# EasyEDA schematic SCH_Akira Basic_2024-01-05.json

## Sheets
1 Sheet_1: TITLE: Akira Basic; REV: 1.2; Date: 2023-07-19; Sheet: 1/2; Company: Pen Design
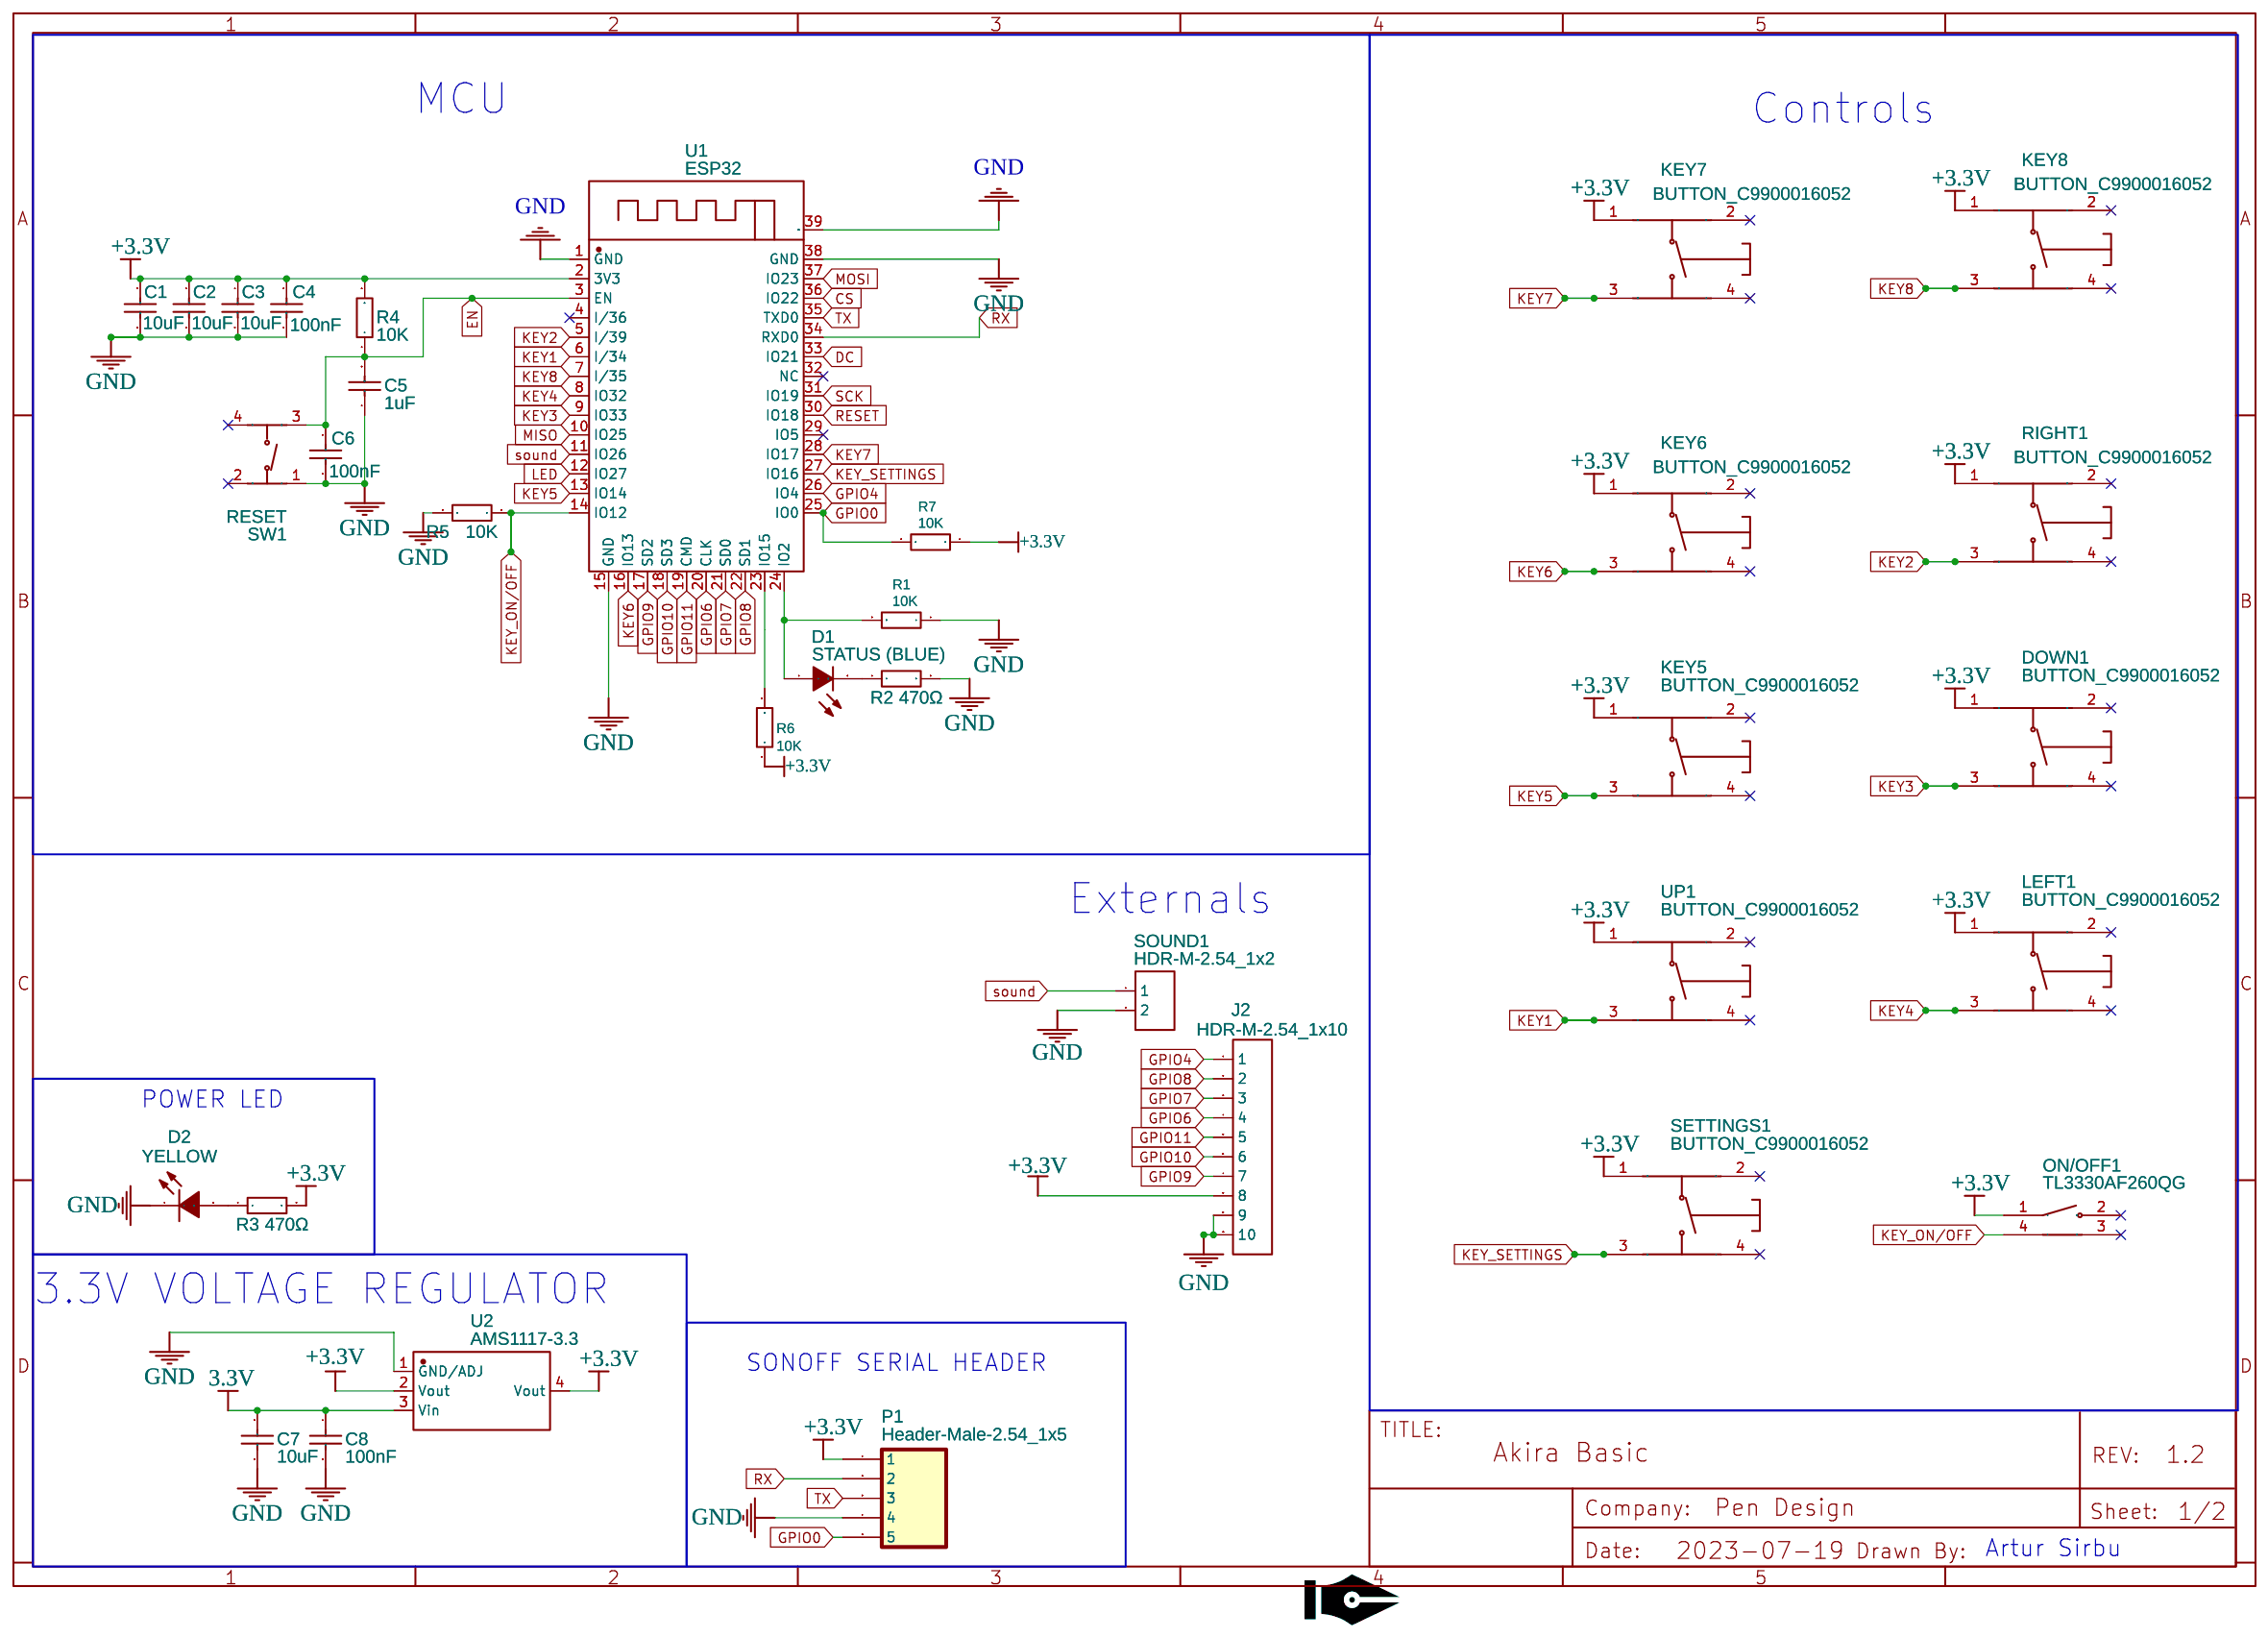
[diagram p0: Sheet_1]
2 Sheet_2: Sheet: 2/2
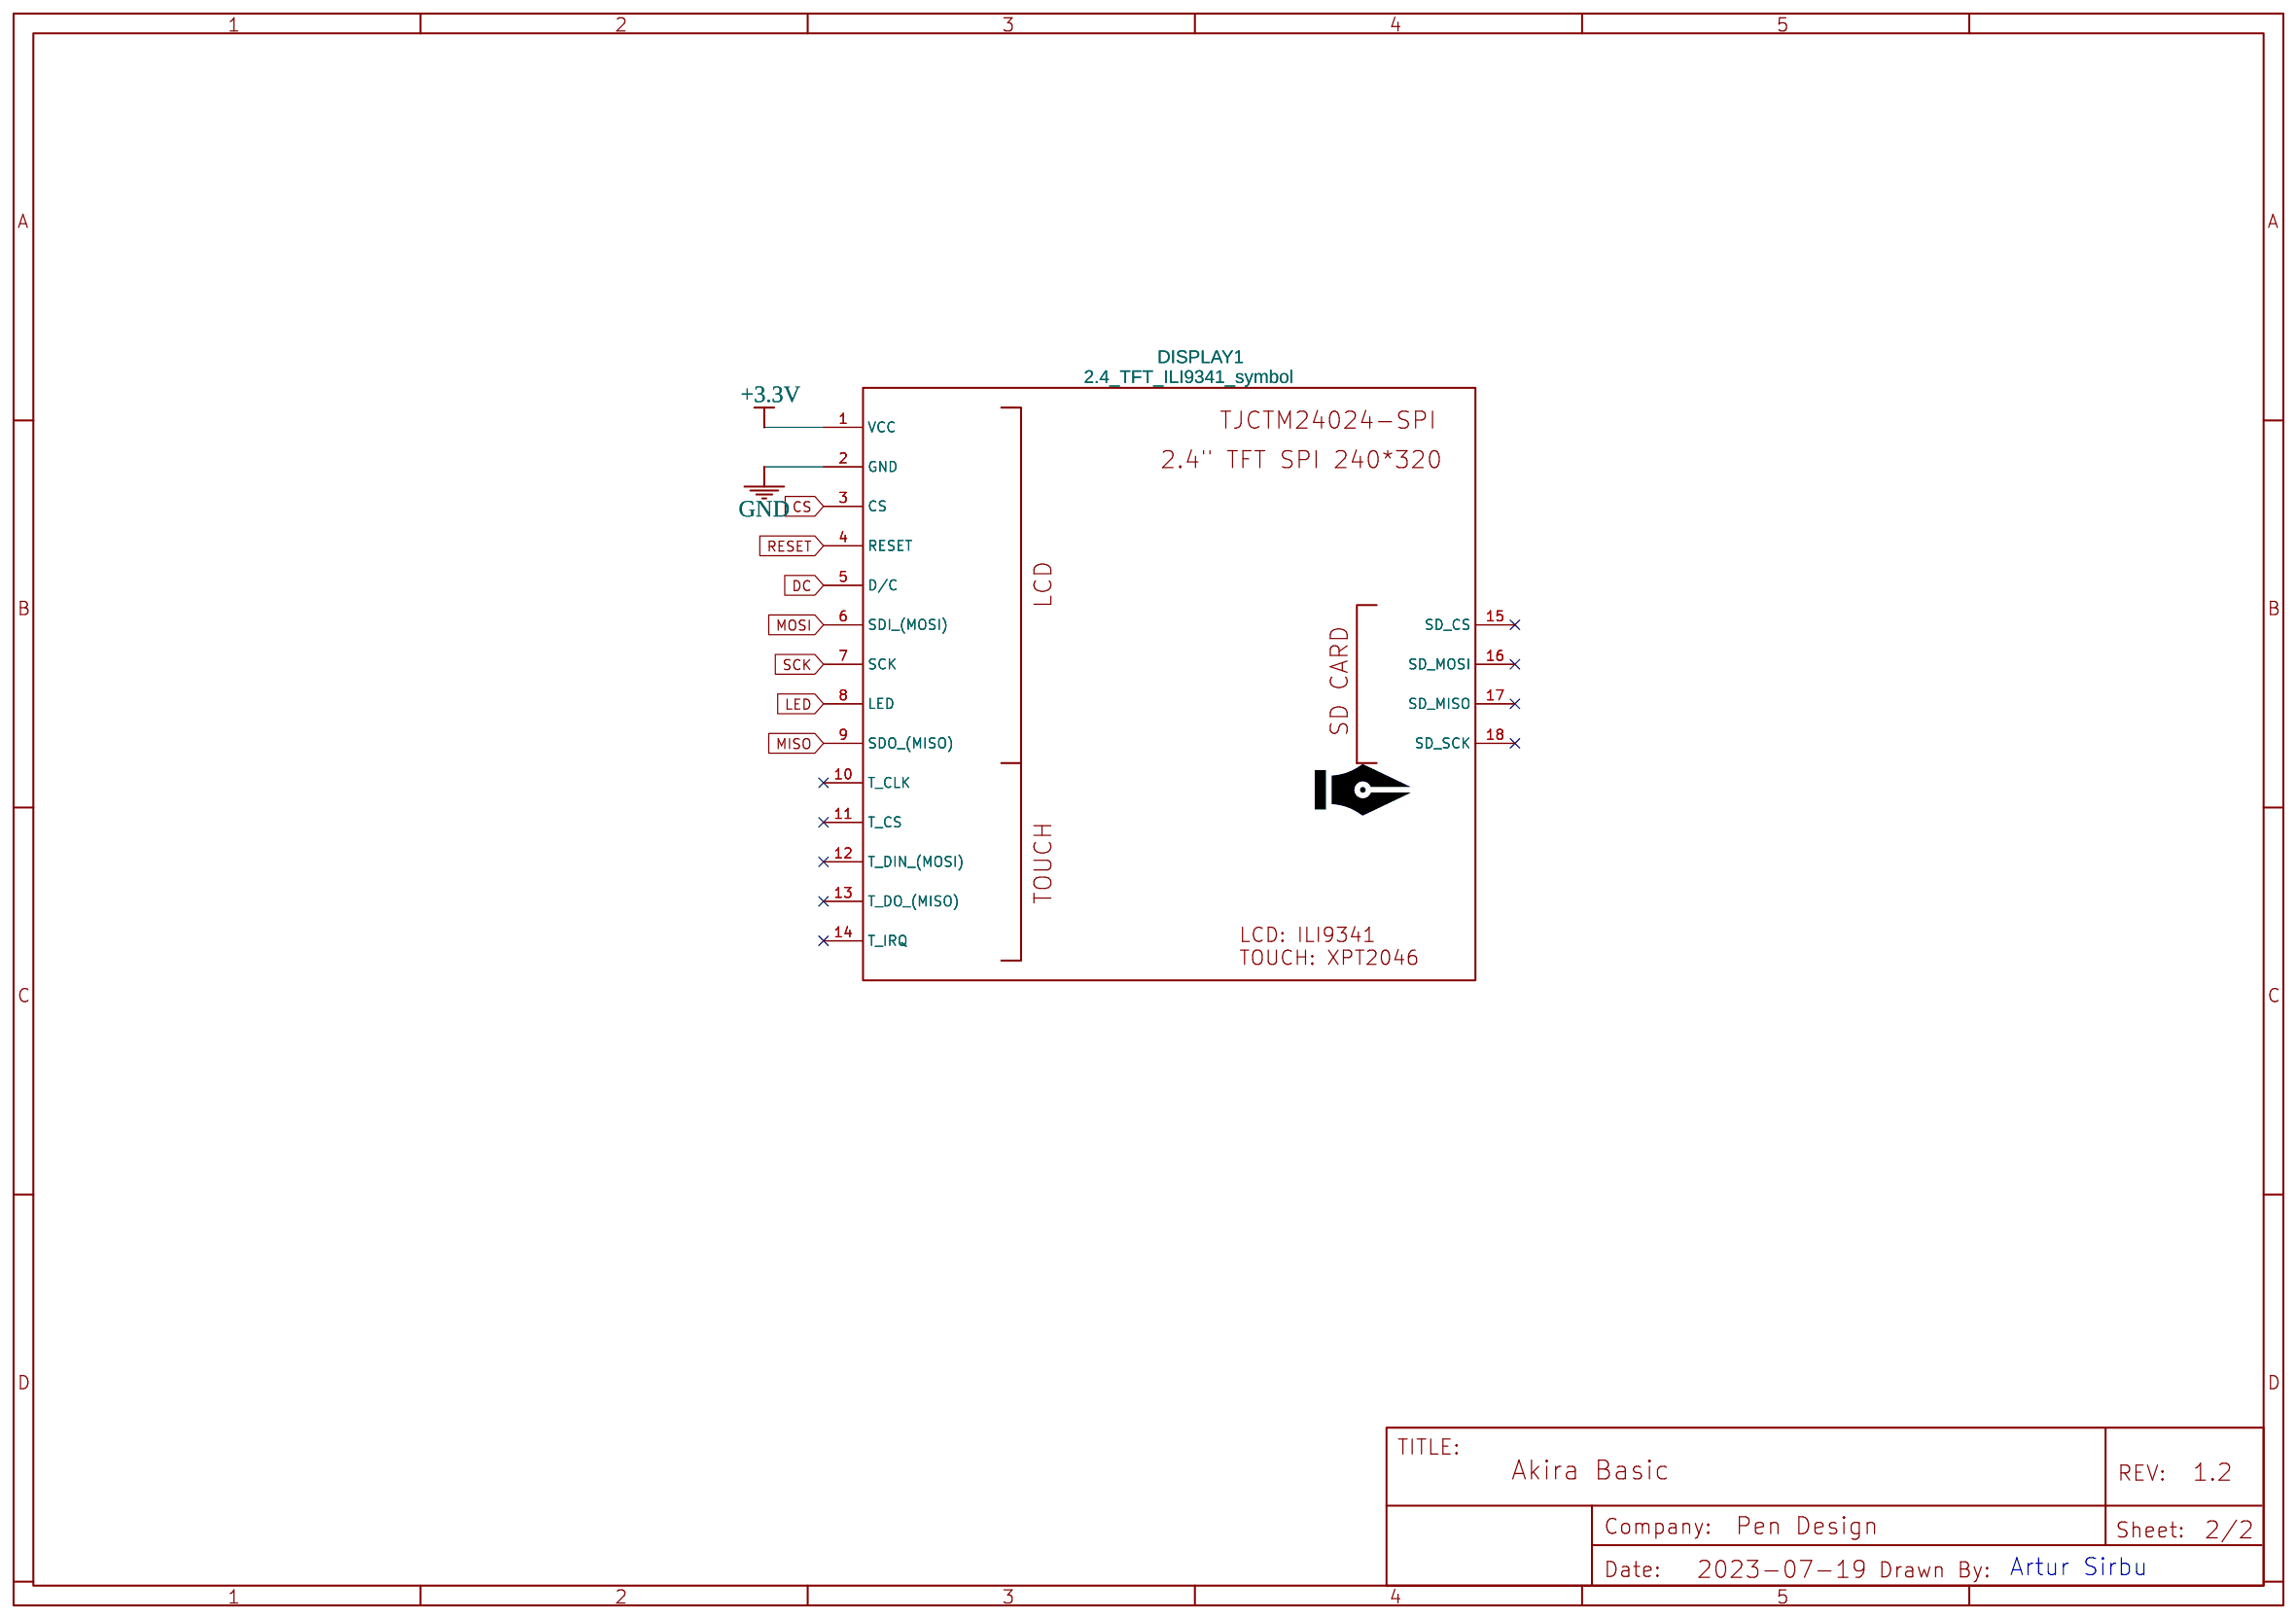
[diagram p1: Sheet_2]

## Parts
sheet Sheet_1
C1  10uF  [C0805]
C2  10uF  [C0805]
C3  10uF  [C0805]
C4  100nF  [C0805]
C5  1uF  [C0805]
C6  100nF  [C0805]
C7  10uF  [C0805]
C8  100nF  [C0805]
D1  STATUS (BLUE)  [LED0603-R-RD]
D2  YELLOW  [LED0805-RD]
DOWN1  BUTTON_C9900016052  [SW-SMD_4P-L5.1-W5.1-P3.70-LS6.5-TL-2]
J2  HDR-M-2.54_1x10  [HDR-M-2.54_1X10]
KEY5  BUTTON_C9900016052  [SW-SMD_4P-L5.1-W5.1-P3.70-LS6.5-TL-2]
KEY6  BUTTON_C9900016052  [SW-SMD_4P-L5.1-W5.1-P3.70-LS6.5-TL-2]
KEY7  BUTTON_C9900016052  [SW-SMD_4P-L5.1-W5.1-P3.70-LS6.5-TL-2]
KEY8  BUTTON_C9900016052  [SW-SMD_4P-L5.1-W5.1-P3.70-LS6.5-TL-2]
LEFT1  BUTTON_C9900016052  [SW-SMD_4P-L5.1-W5.1-P3.70-LS6.5-TL-2]
ON/OFF1  TL3330AF260QG  [SW-SMD_E-SWITCH_TL3330]
P1  Header-Male-2.54_1x5  [HDR-5X1/2.54]
R1  10K  [R0805]
R2  470Ω  [R0805]
R3  470Ω  [R0805]
R4  10K  [R0805]
R5  10K  [R0805]
R6  10K  [R0805]
R7  10K  [R0805]
RIGHT1  BUTTON_C9900016052  [SW-SMD_4P-L5.1-W5.1-P3.70-LS6.5-TL-2]
SETTINGS1  BUTTON_C9900016052  [SW-SMD_4P-L5.1-W5.1-P3.70-LS6.5-TL-2]
SOUND1  HDR-M-2.54_1x2  [HDR-M-2.54_1X2]
SW1  RESET  [SW-SMD_4P-L5.1-W5.1-P3.70-LS6.5-TL-2]
U1  ESP32  [WIFIM-SMD_38P-L19.2-W18.0-P1.27]
U2  AMS1117-3.3  [SOT-223-3_L6.5-W3.4-P2.30-LS7.0-BR]
UP1  BUTTON_C9900016052  [SW-SMD_4P-L5.1-W5.1-P3.70-LS6.5-TL-2]
sheet Sheet_2
DISPLAY1  2.4_TFT_ILI9341_symbol  [ILI9341_320X240_TFT_LCD]

## Library data of the parts
C1-C3 = CL21A106KAYNNNE: Supplier: LCSC; Manufacturer: SAMSUNG; Supplier Part: C15850; SMT Type: Basic; JLCPCB SMD: Yes; LCSC Assembly: Yes; Paste Type: base
C4 C6 = CC0805KRX7R9BB104: Supplier: LCSC; Manufacturer: YAGEO; Supplier Part: C49678; SMT Type: Basic; JLCPCB SMD: Yes; LCSC Assembly: Yes; Paste Type: base
C5 = CL21B105KBFNNNE: Supplier: LCSC; Manufacturer: SAMSUNG; Supplier Part: C28323; SMT Type: Basic; JLCPCB SMD: Yes; LCSC Assembly: Yes; Paste Type: base
C7 = CL21A106KAYNNNE: Supplier: LCSC; Manufacturer: SAMSUNG; Supplier Part: C15850; JLCPCB Part Class: Basic Part
C8 = CC0805KRX7R9BB104: Supplier: LCSC; Manufacturer: YAGEO; LCSC Assembly: Yes; Supplier Part: C49678; SMT Type: Basic
D1 = 19-217/BHC-ZL1M2RY/3T: Supplier: LCSC; Manufacturer: EVERLIGHT; Supplier Part: C72041; JLCPCB Part Class: Basic Part
D2 = 17-21SUYC/TR8: Supplier: LCSC; Manufacturer: KENTO; Supplier Part: C2296; JLCPCB Part Class: Basic Part
DOWN1 KEY5-KEY8 LEFT1 RIGHT1 SETTINGS1 UP1 = BUTTON_C9900016052: Supplier: LCSC; Supplier Part: C9900016052; Manufacturer: null; Manufacturer Part: button; Contributor: lcsc; JLCPCB Part Class: Extended Part
J2 = HDR-M-2.54_1x10: Supplier Part: C57369; Supplier: LCSC; Contributor: LCEDA_Lib
ON/OFF1 = TL3330AF260QG: Supplier: LCSC; Supplier Part: C2886886; Manufacturer: E-Switch; Contributor: LCSC; JLCPCB Part Class: Extended Part
P1 = Header-Male-2.54_1x5: Manufacturer: LCSC
R1 R4-R7 = 0805W8F1002T5E: Supplier: LCSC; Manufacturer: UniOhm; Supplier Part: C17414; SMT Type: Basic; JLCPCB SMD: Yes; LCSC Assembly: Yes; Paste Type: base
R2 R3 = 0805W8F4700T5E: Supplier: LCSC; Manufacturer: UniOhm; Supplier Part: C17710; Resistance (Ohms): 470; JLCPCB Part Class: Basic Part
SOUND1 = HDR-M-2.54_1x2: Supplier Part: C124375; Supplier: LCSC; Contributor: LCEDA_Lib
SW1 = TS-1187A-B-A-B: Supplier: LCSC; Supplier Part: C318884; Manufacturer: XKB Enterprise; Contributor: LCSC; JLCPCB Part Class: Basic Part
U1 = ESP32-WROOM-32U: Supplier: LCSC; Supplier Part: C328062; Contributor: LCSC; LCSC Assembly: No; SMT Type: Extend; Paste Type: expand
U2 = AMS1117-3.3: sourceId: dwIGgezVh; Supplier: LCSC; Manufacturer: AMS; LCSC Assembly: Yes; image: //image.lceda.cn/szlcsc/C6186.jpg; Supplier Part: C6186; SMT Type: Basic
DISPLAY1 = 2.4_TFT_ILI9341_symbol: Contributor: Myk-13; Supplier Part: ili9341-24-touch; Supplier: Nettigo; Author: Krzysztof Daszuta; sourceId: sMic5nFXR

## Nets
3.3V: C7.2 C8.1 U2.3(Vin)
+3.3V: C1.2 C2.2 C3.1 C4.2 DISPLAY1.1(VCC) DOWN1.1 J2.8 KEY5.1 KEY6.1 KEY7.1 KEY8.1 LEFT1.1 ON/OFF1.1 P1.1 R3.2 R4.2 R6.1 R7.1 RIGHT1.1 SETTINGS1.1 U1.2(3V3) U2.2(Vout) U2.4(Vout) UP1.1
GND: C1.1 C2.1 C3.2 C4.1 C5.1 C6.1 C7.1 C8.2 D2.1(-) DISPLAY1.2(GND) J2.9 J2.10 P1.4 R1.1 R2.2 R5.1 SOUND1.2 SW1.1(A) U1.1(GND) U1.15(GND) U1.38(GND) U1.39(GND) U2.1(GND/ADJ)
CS: DISPLAY1.3(CS) U1.36(IO22)
DC: DISPLAY1.5(D/C) U1.33(IO21)
EN: C5.2 C6.2 R4.1 SW1.3(C) U1.3(EN)
GPIO0: P1.5 R7.2 U1.25(IO0)
GPIO4: J2.1 U1.26(IO4)
GPIO6: J2.4 U1.20(CLK)
GPIO7: J2.3 U1.21(SD0)
GPIO8: J2.2 U1.22(SD1)
GPIO9: J2.7 U1.17(SD2)
GPIO10: J2.6 U1.18(SD3)
GPIO11: J2.5 U1.19(CMD)
KEY1: U1.6(I/34) UP1.3
KEY2: RIGHT1.3 U1.5(I/39)
KEY3: DOWN1.3 U1.9(IO33)
KEY4: LEFT1.3 U1.8(IO32)
KEY5: KEY5.3 U1.13(IO14)
KEY6: KEY6.3 U1.16(IO13)
KEY7: KEY7.3 U1.28(IO17)
KEY8: KEY8.3 U1.7(I/35)
KEY_ON/OFF: ON/OFF1.4 R5.2 U1.14(IO12)
KEY_SETTINGS: SETTINGS1.3 U1.27(IO16)
LED: DISPLAY1.8(LED) U1.12(IO27)
MISO: DISPLAY1.9(SDO (MISO)) U1.10(IO25)
MOSI: DISPLAY1.6(SDI (MOSI)) U1.37(IO23)
RESET: DISPLAY1.4(RESET) U1.30(IO18)
RX: P1.2 U1.34(RXD0)
SCK: DISPLAY1.7(SCK) U1.31(IO19)
sound: SOUND1.1 U1.11(IO26)
TX: P1.3 U1.35(TXD0)
Net-(D1-1): D1.1(A) R1.2 U1.24(IO2)
Net-(D1-2): D1.2(C) R2.1
Net-(D2-2): D2.2(+) R3.1
Net-(R6-2): R6.2 U1.23(IO15)

Not connected (* = marked no-connect by the designer): DISPLAY1 10(T_CLK)* 11(T_CS)* 12(T_DIN (MOSI))* 13(T_DO (MISO))* 14(T_IRQ)* 15(SD_CS)* 16(SD_MOSI)* 17(SD_MISO)* 18(SD_SCK)*; DOWN1 2* 4*; KEY5 2* 4*; KEY6 2* 4*; KEY7 2* 4*; KEY8 2* 4*; LEFT1 2* 4*; ON/OFF1 2* 3*; RIGHT1 2* 4*; SETTINGS1 2* 4*; SW1 2(B)* 4(D)*; U1 4(I/36)* 29(IO5)* 32(NC)*; UP1 2* 4*

## Notes on the sheets
sheet 1
- MCU
- Controls
- Externals
- POWER LED
- 3.3V VOLTAGE REGULATOR
- SONOFF SERIAL HEADER
- Artur Sirbu
sheet 2
- Artur Sirbu
